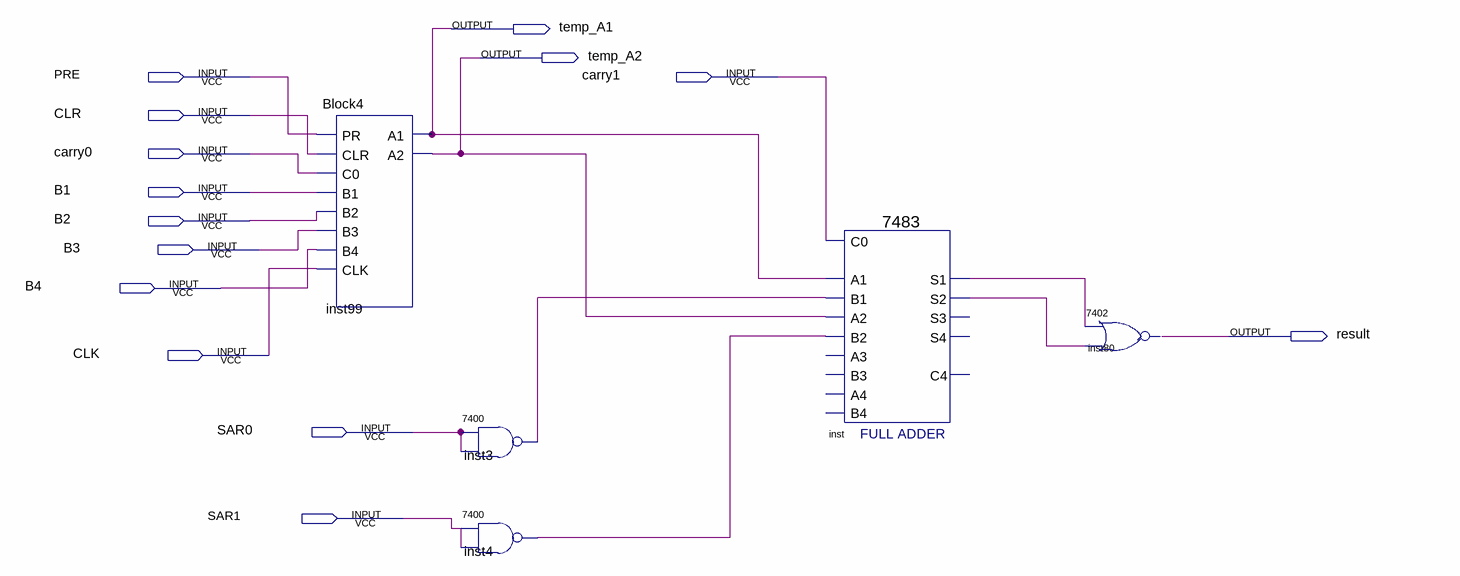
[diagram p0: schematic sheet]
// Quartus schematic Block5.bdf as structural Verilog: 5 symbols, 14 pins
module Block5 (
  input  PRE,
  input  carry1,
  input  CLR,
  input  carry0,
  input  B1,
  input  B2,
  input  B3,
  input  B4,
  input  CLK,
  input  SAR0,
  input  SAR1,
  output temp_A1,
  output temp_A2,
  output result
);

  wire inst3_1, inst4_1, inst_s1, inst_s2;

  Block4 inst99 (
    .PR(PRE), .CLR(CLR), .C0(carry0), .B1(B1), .B2(B2), .B3(B3), .B4(B4), .CLK(CLK), .A1(temp_A1),
    .A2(temp_A2));
  \7400  inst3 (.\3 (SAR0), .\2 (SAR0), .\1 (inst3_1));
  \7400  inst4 (.\3 (SAR1), .\2 (SAR1), .\1 (inst4_1));
  \7483  inst (
    .C0(carry1), .A1(temp_A1), .A2(temp_A2), .B1(inst3_1), .B2(inst4_1), .S2(inst_s2), .S1(inst_s1));  // open: B4, A3, B3, A4, S3, S4, C4
  \7402  inst80 (.\2 (inst_s1), .\3 (inst_s2), .\1 (result));
endmodule
